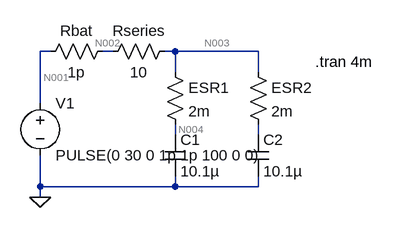
[diagram p0: schematic inrush_current_limiter.asc]
inrush_current_limiter.asc, the LTspice schematic file:
Version 4
SHEET 1 880 680
WIRE 16 64 0 64
WIRE 112 64 96 64
WIRE 208 64 192 64
WIRE 336 64 208 64
WIRE 208 96 208 64
WIRE 336 96 336 64
WIRE 0 144 0 64
WIRE 208 192 208 176
WIRE 336 192 336 176
WIRE 0 272 0 224
WIRE 208 272 208 256
WIRE 208 272 0 272
WIRE 336 272 336 256
WIRE 336 272 208 272
WIRE 0 288 0 272
FLAG 0 288 0
SYMBOL voltage 0 128 R0
WINDOW 123 0 0 Left 0
WINDOW 39 0 0 Left 0
SYMATTR InstName V1
SYMATTR Value PULSE(0 30 0 1p 1p 100 0 0)
SYMBOL cap 192 192 R0
SYMATTR InstName C1
SYMATTR Value 10.1µ
SYMBOL res 192 80 R0
SYMATTR InstName ESR1
SYMATTR Value 2m
SYMBOL res 96 80 R270
WINDOW 0 32 56 VTop 2
WINDOW 3 0 56 VBottom 2
SYMATTR InstName Rseries
SYMATTR Value 10
SYMBOL res 0 80 R270
WINDOW 0 32 56 VTop 2
WINDOW 3 0 56 VBottom 2
SYMATTR InstName Rbat
SYMATTR Value 1p
SYMBOL res 320 80 R0
SYMATTR InstName ESR2
SYMATTR Value 2m
SYMBOL cap 320 192 R0
SYMATTR InstName C2
SYMATTR Value 10.1µ
TEXT 424 80 Left 2 !.tran 4m

The netlist it stands for:
* inrush_current_limiter.asc
V1 N001 0 PULSE(0 30 0 1p 1p 100 0 0)
C1 N004 0 10.1µ
R§ESR1 N003 N004 2m
Rseries N002 N003 10
Rbat N001 N002 1p
R§ESR2 N003 N005 2m
C2 N005 0 10.1µ
.tran 4m
.backanno
.end

* Results of the author's LTspice run, read from the files saved beside the schematic
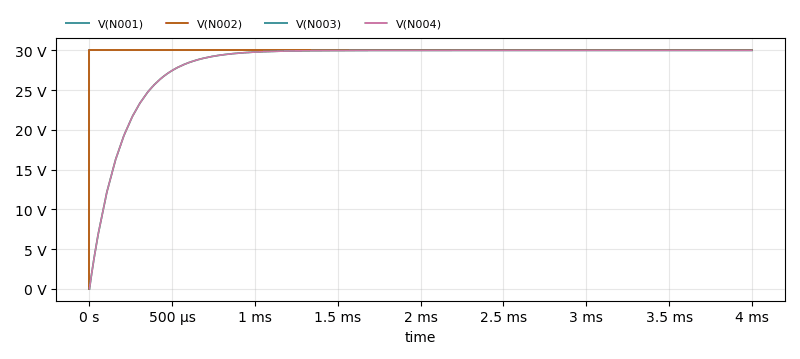
[diagram p1: Transient Analysis of inrush_current_limiter.asc, plotted from the saved traces]
* Transient Analysis, 1 run:
*   V(N001): min 0 V, max 30 V, average 30 V, rms 30 V, last 30 V
*   V(N002): min 0 V, max 30 V, average 30 V, rms 30 V, last 30 V
*   V(N003): min 0 V, max 30 V, average 28.48 V, rms 28.84 V, last 30 V
*   V(N004): min 0 V, max 30 V, average 28.48 V, rms 28.84 V, last 30 V